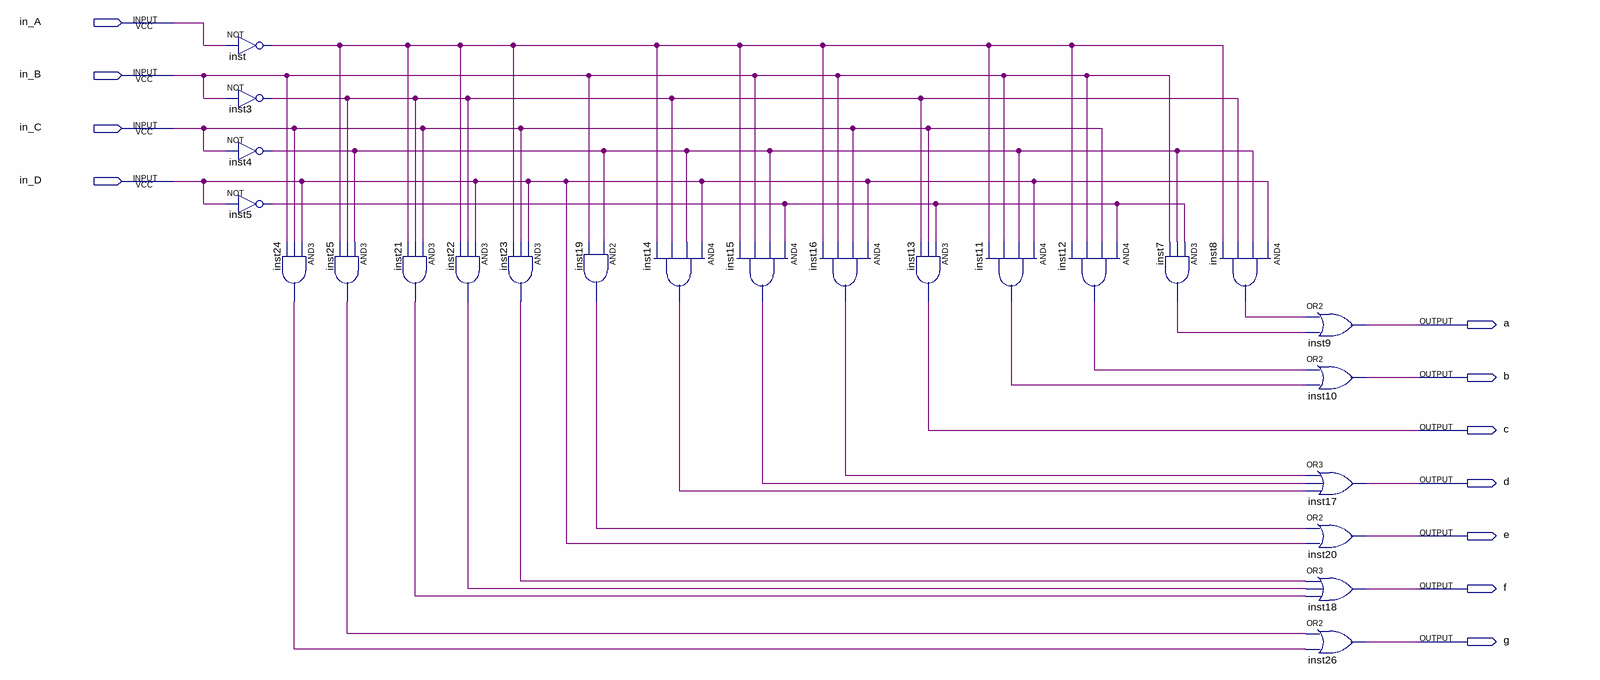
[diagram p0: schematic sheet]
// Quartus schematic decoderBCD7segments.bdf as structural Verilog: 24 symbols, 11 pins
module decoderBCD7segments (
  input  in_A,
  input  in_B,
  input  in_C,
  input  in_D,
  output a,
  output b,
  output c,
  output d,
  output e,
  output f,
  output g
);

  wire inst3_out, inst4_out, inst5_out, inst7_out, inst8_out, inst11_out, inst12_out, inst14_out, inst15_out,
       inst16_out, inst19_out, inst21_out, inst22_out, inst23_out, inst24_out, inst25_out, inst_out;

  not inst (inst_out, in_A);
  not inst3 (inst3_out, in_B);
  not inst4 (inst4_out, in_C);
  not inst5 (inst5_out, in_D);
  and inst24 (inst24_out, in_D, in_C, in_B);
  and inst25 (inst25_out, inst4_out, inst3_out, inst_out);
  and inst21 (inst21_out, in_C, inst3_out, inst_out);
  and inst22 (inst22_out, in_D, inst3_out, inst_out);
  and inst23 (inst23_out, in_D, in_C, inst_out);
  and inst19 (inst19_out, inst4_out, in_B);
  and inst14 (inst14_out, in_D, inst4_out, inst3_out, inst_out);
  and inst15 (inst15_out, inst5_out, inst4_out, in_B, inst_out);
  and inst16 (inst16_out, in_D, in_C, in_B, inst_out);
  and inst13 (c, inst5_out, in_C, inst3_out);
  and inst11 (inst11_out, in_D, inst4_out, in_B, inst_out);
  and inst12 (inst12_out, inst5_out, in_C, in_B, inst_out);
  and inst7 (inst7_out, inst5_out, inst4_out, in_B);
  and inst8 (inst8_out, in_D, inst4_out, inst3_out, inst_out);
  or inst9 (a, inst8_out, inst7_out);
  or inst10 (b, inst12_out, inst11_out);
  or inst17 (d, inst16_out, inst15_out, inst14_out);
  or inst20 (e, inst19_out, in_D);
  or inst18 (f, inst23_out, inst22_out, inst21_out);
  or inst26 (g, inst25_out, inst24_out);
endmodule
